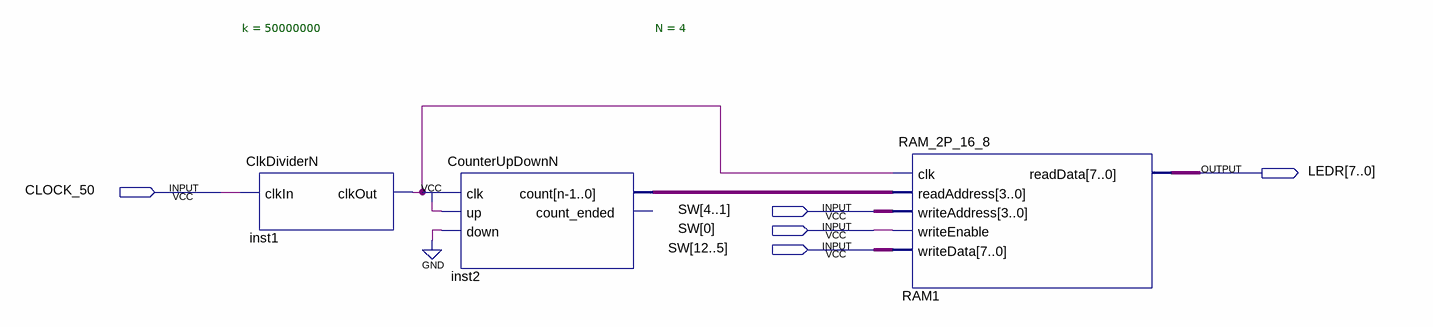
[diagram p0: schematic sheet]
// Quartus schematic RAM_2P_Demo.bdf as structural Verilog: 3 symbols, 5 pins
module RAM_2P_Demo (
  input  CLOCK_50,
  input  [12:0] SW,
  output [7:0] LEDR
);

  wire inst1_clkout;
  wire [3:0] inst2_count;

  ClkDividerN #(.k(50000000)) inst1 (.clkIn(CLOCK_50), .clkOut(inst1_clkout));
  CounterUpDownN #(.N(4)) inst2 (.clk(inst1_clkout), .up(1'b1), .down(1'b0), .count(inst2_count));  // open: count_ended
  RAM_2P_16_8 RAM1 (
    .clk(inst1_clkout), .readAddress(inst2_count), .writeAddress(SW[4:1]), .writeEnable(SW[0]),
    .writeData(SW[12:5]), .readData(LEDR));
endmodule
